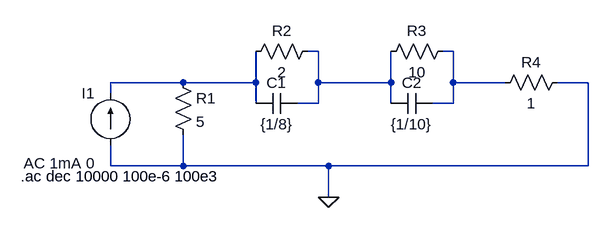
[diagram p0: schematic TS13_1.asc]
TS13_1.asc, the LTspice schematic file:
Version 4
SHEET 1 880 680
WIRE 208 48 192 48
WIRE 416 48 400 48
WIRE 0 96 -112 96
WIRE 112 96 112 48
WIRE 112 96 0 96
WIRE 208 96 208 48
WIRE 320 96 320 48
WIRE 320 96 208 96
WIRE 416 96 416 48
WIRE 496 96 416 96
WIRE 624 96 576 96
WIRE -112 112 -112 96
WIRE 112 128 112 96
WIRE 208 128 208 96
WIRE 208 128 176 128
WIRE 320 128 320 96
WIRE 416 128 416 96
WIRE 416 128 384 128
WIRE -112 224 -112 192
WIRE 0 224 0 176
WIRE 0 224 -112 224
WIRE 224 224 0 224
WIRE 624 224 624 96
WIRE 624 224 224 224
WIRE 224 272 224 224
FLAG 224 272 0
SYMBOL res -16 80 R0
SYMATTR InstName R1
SYMATTR Value 5
SYMBOL res 208 32 R90
WINDOW 0 0 56 VBottom 2
WINDOW 3 32 56 VTop 2
SYMATTR InstName R2
SYMATTR Value 2
SYMBOL res 416 32 R90
WINDOW 0 0 56 VBottom 2
WINDOW 3 32 56 VTop 2
SYMATTR InstName R3
SYMATTR Value 10
SYMBOL res 592 80 R90
WINDOW 0 0 56 VBottom 2
WINDOW 3 32 56 VTop 2
SYMATTR InstName R4
SYMATTR Value 1
SYMBOL cap 176 112 R90
WINDOW 0 0 32 VBottom 2
WINDOW 3 32 32 VTop 2
SYMATTR InstName C1
SYMATTR Value {1/8}
SYMBOL cap 384 112 R90
WINDOW 0 0 32 VBottom 2
WINDOW 3 32 32 VTop 2
SYMATTR InstName C2
SYMATTR Value {1/10}
SYMBOL current -112 192 R180
WINDOW 0 24 80 Left 2
WINDOW 3 24 0 Left 2
WINDOW 123 24 -28 Left 2
WINDOW 39 0 0 Left 0
SYMATTR InstName I1
SYMATTR Value ""
SYMATTR Value2 AC 1mA 0
TEXT -250 240 Left 2 !.ac dec 10000 100e-6 100e3

The netlist it stands for:
* TS13_1.asc
R1 N003 0 5
R2 N001 N003 2
R3 N002 N001 10
R4 0 N002 1
C1 N001 N003 {1/8}
C2 N002 N001 {1/10}
I1 0 N003 AC 1mA 0
.ac dec 10000 100e-6 100e3
.backanno
.end